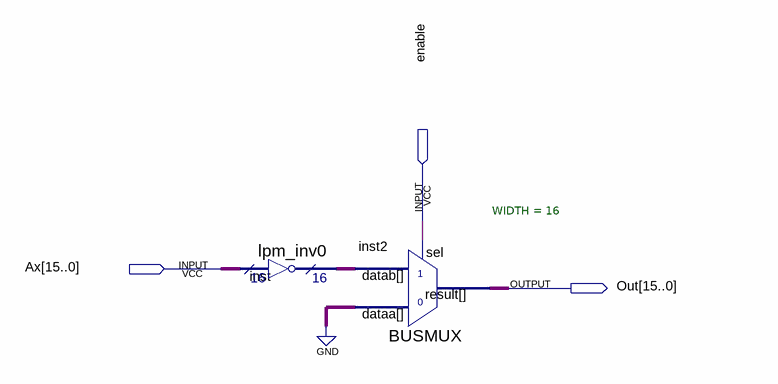
[diagram p0: schematic sheet]
// Quartus schematic ALU_NOT.bdf as structural Verilog: 2 symbols, 3 pins
module ALU_NOT (
  input  enable,
  input  [15:0] Ax,
  output [15:0] Out
);

  wire [15:0] inst_result;

  lpm_inv0 inst (.data(Ax), .result(inst_result));
  BUSMUX #(.WIDTH(16)) inst2 (.datab(inst_result), .sel(enable), .dataa({16{1'b0}}), .result(Out));
endmodule
